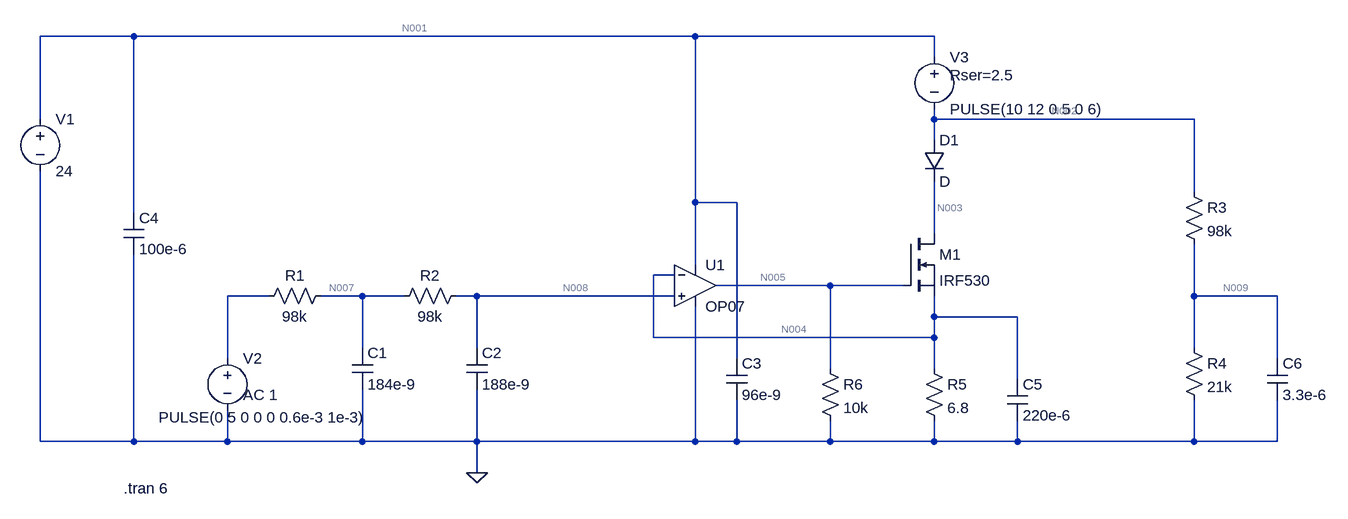
[diagram p0: schematic Schematics_NEW.asc]
Schematics_NEW.asc, the LTspice schematic file:
Version 4
SHEET 1 2012 680
WIRE -80 -208 -224 -208
WIRE 784 -208 -80 -208
WIRE 1152 -208 784 -208
WIRE 1152 -176 1152 -208
WIRE -224 -80 -224 -208
WIRE 1152 -80 1152 -96
WIRE 1552 -80 1152 -80
WIRE 1152 -48 1152 -80
WIRE 1552 32 1552 -80
WIRE 784 48 784 -208
WIRE 848 48 784 48
WIRE -80 64 -80 -208
WIRE 1152 96 1152 16
WIRE 784 144 784 48
WIRE 752 160 720 160
WIRE 992 176 816 176
WIRE 1104 176 992 176
WIRE 128 192 64 192
WIRE 272 192 208 192
WIRE 336 192 272 192
WIRE 448 192 416 192
WIRE 752 192 448 192
WIRE 1552 192 1552 112
WIRE 1680 192 1552 192
WIRE 1152 224 1152 192
WIRE 1280 224 1152 224
WIRE 720 256 720 160
WIRE 1152 256 1152 224
WIRE 1152 256 720 256
WIRE 272 272 272 192
WIRE 448 272 448 192
WIRE 1552 272 1552 192
WIRE 64 288 64 192
WIRE 848 288 848 48
WIRE 1680 288 1680 192
WIRE 992 304 992 176
WIRE 1152 304 1152 256
WIRE 1280 320 1280 224
WIRE -224 416 -224 0
WIRE -80 416 -80 128
WIRE -80 416 -224 416
WIRE 64 416 64 368
WIRE 64 416 -80 416
WIRE 272 416 272 336
WIRE 272 416 64 416
WIRE 448 416 448 336
WIRE 448 416 272 416
WIRE 784 416 784 208
WIRE 784 416 448 416
WIRE 848 416 848 352
WIRE 848 416 784 416
WIRE 992 416 992 384
WIRE 992 416 848 416
WIRE 1152 416 1152 384
WIRE 1152 416 992 416
WIRE 1280 416 1280 384
WIRE 1280 416 1152 416
WIRE 1552 416 1552 352
WIRE 1552 416 1280 416
WIRE 1680 416 1680 352
WIRE 1680 416 1552 416
WIRE 448 464 448 416
FLAG 448 464 0
SYMBOL voltage -224 -96 R0
WINDOW 123 0 0 Left 0
WINDOW 39 0 0 Left 0
SYMATTR InstName V1
SYMATTR Value 24
SYMBOL voltage 64 272 R0
WINDOW 3 -106 107 Left 2
WINDOW 123 24 72 Left 2
WINDOW 39 0 0 Left 0
SYMATTR Value PULSE(0 5 0 0 0 0.6e-3 1e-3)
SYMATTR Value2 AC 1
SYMATTR InstName V2
SYMBOL res 224 176 R90
WINDOW 0 0 56 VBottom 2
WINDOW 3 32 56 VTop 2
SYMATTR InstName R1
SYMATTR Value 98k
SYMBOL res 1136 288 R0
SYMATTR InstName R5
SYMATTR Value 6.8
SYMBOL diode 1136 -48 R0
SYMATTR InstName D1
SYMBOL voltage 1152 -192 R0
WINDOW 123 0 0 Left 0
WINDOW 39 24 44 Left 2
SYMATTR SpiceLine Rser=2.5
SYMATTR InstName V3
SYMATTR Value PULSE(10 12 0 5 0 6)
SYMBOL nmos 1104 96 R0
SYMATTR InstName M1
SYMATTR Value IRF530
SYMBOL cap 256 272 R0
SYMATTR InstName C1
SYMATTR Value 184e-9
SYMBOL cap 432 272 R0
SYMATTR InstName C2
SYMATTR Value 188e-9
SYMBOL res 432 176 R90
WINDOW 0 0 56 VBottom 2
WINDOW 3 32 56 VTop 2
SYMATTR InstName R2
SYMATTR Value 98k
SYMBOL Opamps\\OP07 784 112 R0
SYMATTR InstName U1
SYMBOL cap 832 288 R0
SYMATTR InstName C3
SYMATTR Value 96e-9
SYMBOL cap -96 64 R0
SYMATTR InstName C4
SYMATTR Value 100e-6
SYMBOL res 976 288 R0
SYMATTR InstName R6
SYMATTR Value 10k
SYMBOL cap 1264 320 R0
SYMATTR InstName C5
SYMATTR Value 220e-6
SYMBOL res 1536 16 R0
SYMATTR InstName R3
SYMATTR Value 98k
SYMBOL res 1536 256 R0
SYMATTR InstName R4
SYMATTR Value 21k
SYMBOL cap 1664 288 R0
SYMATTR InstName C6
SYMATTR Value 3.3e-6
TEXT -96 488 Left 2 !.tran 6

The netlist it stands for:
* Schematics_NEW.asc
V1 N001 0 24
V2 N006 0 PULSE(0 5 0 0 0 0.6e-3 1e-3) AC 1
R1 N007 N006 98k
R5 N004 0 6.8
D1 N002 N003 D
V3 N001 N002 PULSE(10 12 0 5 0 6) Rser=2.5
M1 N003 N005 N004 N004 IRF530
C1 N007 0 184e-9
C2 N008 0 188e-9
R2 N008 N007 98k
XU1 N008 N004 N001 0 N005 LT1001  ; OP07, pins In+ In- V+ V- OUT
C3 N001 0 96e-9
C4 N001 0 100e-6
R6 N005 0 10k
C5 N004 0 220e-6
R3 N002 N009 98k
R4 N009 0 21k
C6 N009 0 3.3e-6
.model D D
.lib standard.dio
.model NMOS NMOS
.model PMOS PMOS
.lib standard.mos
.tran 6
.lib LTC.lib
.backanno
.end

* Results of the author's LTspice run, read from the files saved beside the schematic
* Operating Point, zero values left out:
*   V(n001) = 24 V
*   V(n007) = 67.46 µV
*   V(n004) = 49.54 mV
*   V(n002) = 13.98 V
*   V(n003) = 13.28 V
*   V(n005) = 4.008 V
*   V(n008) = 134.9 µV
*   V(n009) = 2.467 V
*   Id(M1) = 7.285 mA
*   Is(M1) = -7.285 mA
*   I(D1) = 7.285 mA
*   I(R4) = 117.5 µA
*   I(R3) = 117.5 µA
*   I(R6) = 400.8 µA
*   I(R2) = 688.4 pA
*   I(R5) = 7.285 mA
*   I(R1) = 688.4 pA
*   I(V3) = 7.402 mA
*   I(V2) = 688.4 pA
*   I(V1) = -9.857 mA
*   Ix(u1:1) = -688.4 pA
*   Ix(u1:2) = 645.6 pA
*   Ix(u1:3) = 2.455 mA
*   Ix(u1:4) = -2.054 mA
*   Ix(u1:5) = -400.8 µA